# EAGLE design 1TTR4--- Cumbo.Fabio --- LED Double (EAGLE 7.7.0)
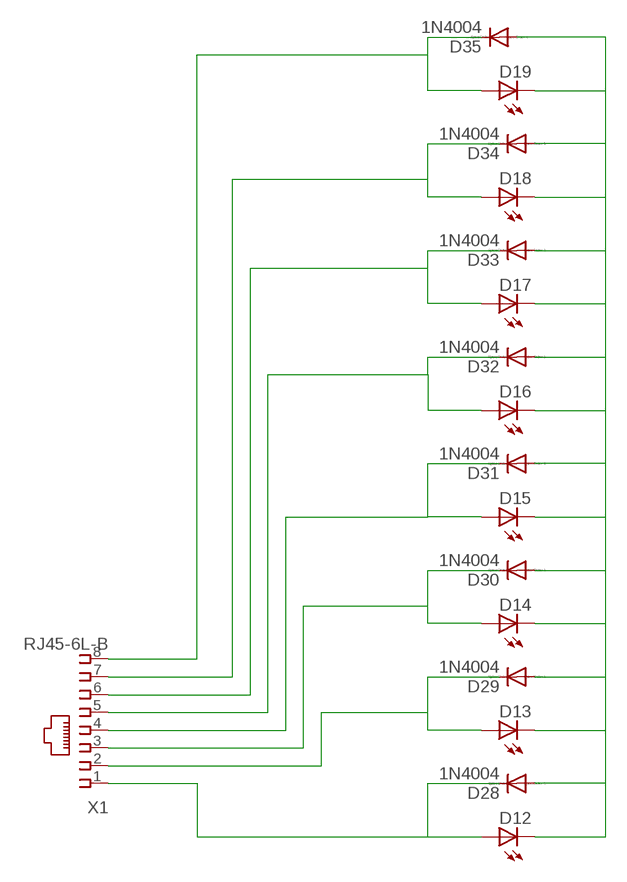
[diagram p0: schematic, sheet 1]

## Parts
D12  LED5MM  [LED5MM]
D13  LED5MM  [LED5MM]
D14  LED5MM  [LED5MM]
D15  LED5MM  [LED5MM]
D16  LED5MM  [LED5MM]
D17  LED5MM  [LED5MM]
D18  LED5MM  [LED5MM]
D19  LED5MM  [LED5MM]
D28  1N4004  [DO41-10]
D29  1N4004  [DO41-10]
D30  1N4004  [DO41-10]
D31  1N4004  [DO41-10]
D32  1N4004  [DO41-10]
D33  1N4004  [DO41-10]
D34  1N4004  [DO41-10]
D35  1N4004  [DO41-10]
X1  RJ45-6L-B  [RJ45-NO-SHIELD]

## Nets
N$1: D12.A D28.C X1.1
N$2: D12.K(C) D13.K(C) D14.K(C) D15.K(C) D16.K(C) D17.K(C) D18.K(C) D19.K(C) D28.A D29.A D30.A D31.A D32.A D33.A D34.A D35.A
N$3: D13.A D29.C X1.2
N$4: D14.A D30.C X1.3
N$5: D15.A D31.C X1.4
N$6: D16.A D32.C X1.5
N$7: D17.A D33.C X1.6
N$8: D18.A D34.C X1.7
N$9: D19.A D35.C X1.8

## Library data of the parts
D12-D19 = led:LED: LED OSRAM: - CHIPLED LG R971, LG N971, LY N971, LG Q971, LY Q971, LO R971, LY R971 LH N974, LH R974 LS Q976, LO Q976, LY Q976 LO Q996 - Hyper CHIPLED LW Q18S LB Q993, LB Q99A, LB R99A - SideLED LS A670, LO A670, LY A670, LG A670, LP A670 LB A673, LV A673, LT A673, LW A673 LH A674 LY A675 LS A676, LA A676, LO A676, LY A676, LW A676 LS A679, LY A679, LG A679 - Hyper Micro SIDELED® LS Y876, LA Y876, LO Y876, LY Y876 LT Y87S - SmartLED LW L88C, LW L88S LB L89C, LB L89S, LG L890 LS L89K, LO L89K, LY L89K LS L896, LA L896, LO L896, LY L896 - TOPLED LS T670, LO T670, LY T670, LG T670, LP T670 LSG T670, LSP T670, LSY T670, LOP T670, LYG T670 LG T671, LOG T671, LSG T671 LB T673, LV T673, LT T673, LW T673 LH T674 LS T676, LA T676, LO T676, LY T676, LB T676, LH T676, LSB T676, LW T676 LB T67C, LV T67C, LT T67C, LS T67K, LO T67K, LY T67K, LW E67C LS E67B, LA E67B, LO E67B, LY E67B, LB E67C, LV E67C, LT E67C LW T67C LS T679, LY T679, LG T679 LS T770, LO T770, LY T770, LG T770, LP T770 LB T773, LV T773, LT T773, LW T773 LH T774 LS E675, LA E675, LY E675, LS T675 LS T776, LA T776, LO T776, LY T776, LB T776 LHGB T686 LT T68C, LB T68C - Hyper Mini TOPLED® LB M676 - Mini TOPLED Santana® LG M470 LS M47K, LO M47K, LY M47K Source: http://www.osram.convergy.de LUXEON: - LUMILED® LXK2-PW12-R00, LXK2-PW12-S00, LXK2-PW14-U00, LXK2-PW14-V00 LXK2-PM12-R00, LXK2-PM12-S00, LXK2-PM14-U00 LXK2-PE12-Q00, LXK2-PE12-R00, LXK2-PE12-S00, LXK2-PE14-T00, LXK2-PE14-U00 LXK2-PB12-K00, LXK2-PB12-L00, LXK2-PB12-M00, LXK2-PB14-N00, LXK2-PB14-P00, LXK2-PB14-Q00 LXK2-PR12-L00, LXK2-PR12-M00, LXK2-PR14-Q00, LXK2-PR14-R00 LXK2-PD12-Q00, LXK2-PD12-R00, LXK2-PD12-S00 LXK2-PH12-R00, LXK2-PH12-S00 LXK2-PL12-P00, LXK2-PL12-Q00, LXK2-PL12-R00 Source: www.luxeon.com KINGBRIGHT: KA-3528ASYC Source: www.kingbright.com
D28-D35 = diode:1N4004: DIODE general purpose rectifier, 1 A
X1 = con-tycoelectronics:RJ45: CORCOM Modular RJ Jacks No Shield Source: www.tycoelectronics.com .. ENG_DS_1654001_1099_RJ_L_0507.pdf; MPN: RJ45-6L-B; OC_FARNELL: unknown; OC_NEWARK: 16R6090

## Net classes
0 default: width 2 mm, drill 0.8 mm, clearance 0.2 mm

## Board
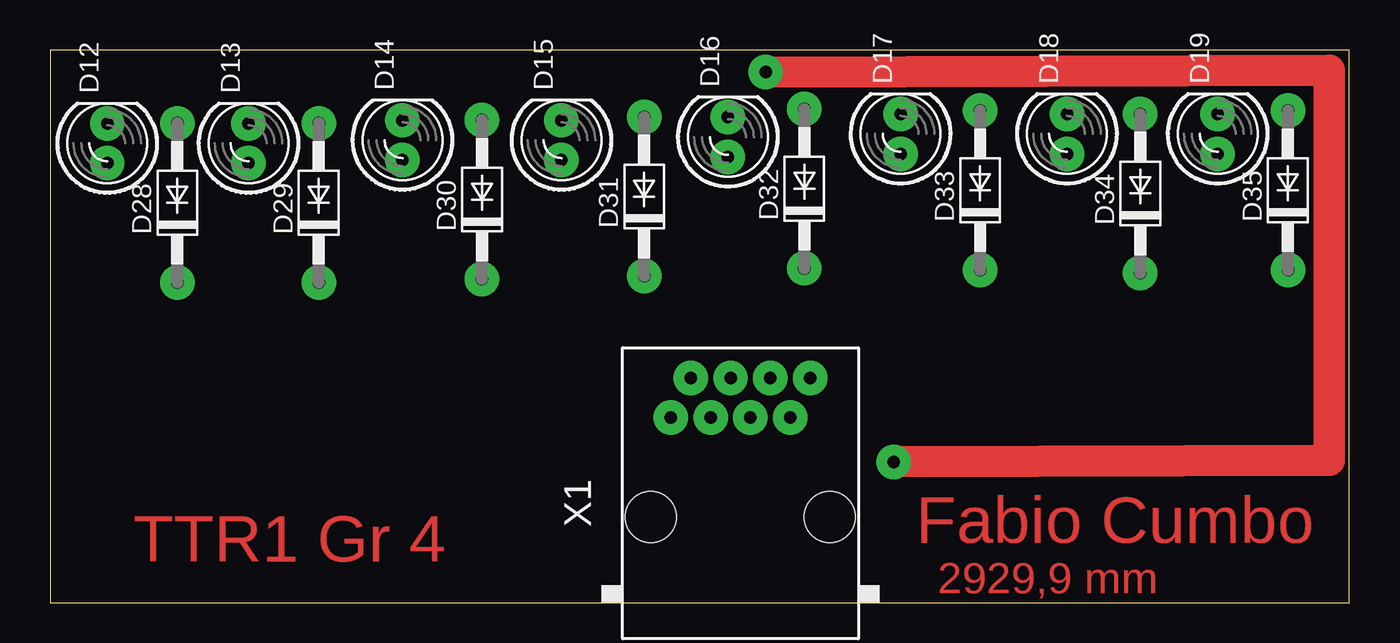
[diagram p1: board, top side]
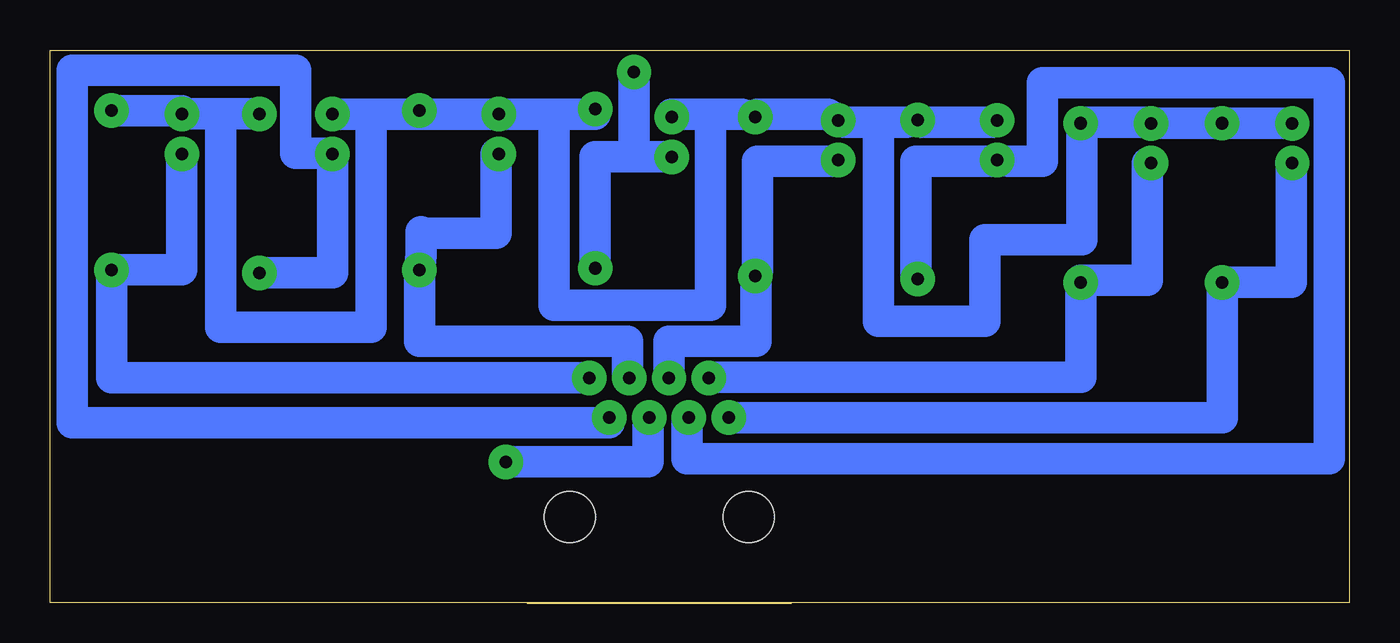
[diagram p2: board, bottom side, seen from below]

Size 83 x 35.33 mm. Coordinates in mm from the lower left corner, seen from the top.
Outline: 0,0.03 83,0.03 83,35.33 0,35.33 0,0.03
Copper layers (1*16): Top 0.035mm / dielectric 1.5mm / Bottom 0.035mm
Design rules "default": minimum track width 10mil, minimum drill 24mil, track to track 8mil, track to pad 8mil, pad to pad 8mil, via to via 8mil, smd to smd 8mil, copper to edge 40mil, drill to drill 8mil, minimum pad ring 10mil, minimum via ring 8mil, stop-mask expansion 4mil, vias tented up to drill 0mil, thermal gap 10mil

### Footprints (pad centres in the part's own frame; a part is rotated, then mirrored left to right if it is on the bottom)
LED5MM = drill 0.8 pad 2.2: A -1.27,0; K 1.27,0
DO41-10 = drill 0.8 pad 2.2: A 5.08,0; C -5.08,0
RJ45-NO-SHIELD = drill 0.8 pad 2.2: 1 -4.445,6.35; 2 -3.175,8.89; 3 -1.905,6.35; 4 -0.635,8.89; 5 0.635,6.35; 6 1.905,8.89; 7 3.175,6.35; 8 4.445,8.89 | hole 3.251: -5.715,0; 5.715,0

### Placement (x,y rotation side)
D12  3.65,29.38 90 top
D13  12.68,29.38 90 top
D14  22.51,29.58 90 top
D15  32.67,29.58 90 top
D16  43.3,29.78 90 top
D17  54.33,29.98 90 top
D18  64.96,29.98 90 top
D19  74.59,29.98 90 top
D28  8.13,25.58 90 top
D29  17.16,25.58 90 top
D30  27.59,25.78 90 top
D31  37.95,25.98 90 top
D32  48.18,26.48 90 top
D33  59.41,26.38 90 top
D34  69.64,26.18 90 top
D35  79.07,26.38 90 top
X1  44.1,5.51 0 top

### Tracks (layer width: path | path; a pad name or v marks a point on that pad's centre or on a via)
N$1
  Bottom 2: X1.1 8.13,11.86 D28.C 3.7,20.5 3.7,28.11 D12.A
N$2
  Bottom 2: 17.1,30.73 D29.A | D14.K 22.8,30.73 27.3,30.73 D30.A 28.3,30.73 30.1,30.73 | 30.1,30.73 32.3,30.73 D15.K 33.3,31.23 37.8,31.23 D31.A 38.8,31.23 40.8,31.23 | 17.1,30.73 17.1,23.23 23.3,23.23 23.3,18.03 30.1,18.03 30.1,30.73 | 40.8,31.23 43.3,31.23 D16.K | 40.8,31.23 40.8,19.03 50.8,19.03 50.8,31.23 | 50.8,31.23 50.8,31.25 D17.K 59.41,31.25 D33.A 59.5,31.46 59.5,31.23 62.5,31.23 | 62.5,31.23 62.5,17.63 72.1,17.63 72.1,31.26 D34.A D19.K 74.59,31.46 D35.A | 62.5,31.23 64.96,31.23 D18.K | D12.K D28.A D13.K 12.68,30.73 17.1,30.73 | 50.8,31.23 48.18,31.23 D32.A
N$3
  Bottom 2: X1.2 40.92,14.43 17.16,14.43 D29.C 17.16,20.63 12.9,20.63 12.9,28.11 D13.A
N$4
  Bottom 2: D30.C 27.7,20.73 27.7,28.23 22.8,28.23 D14.A 21.8,28.23 19.6,28.23 19.6,33.23 1.3,33.23 1.3,9.23 42.3,9.23 42.3,11.86 X1.3
N$5
  Bottom 2: D15.A 32.8,28.23 37.8,28.23 37.8,21.23 D31.C 37.9,20.9 37.9,16.73 43.46,16.73 X1.4
N$6  (via drill 0.8 pad 2.2)
  Top 2: v53.9,9.03 81.7,9.13 81.7,34.03 v45.7,33.93
  Bottom 2: X1.5 44.8,11.23 44.8,9.03 v53.9,9.03 | 45.7,28.53 48.18,28.53 D32.C | v45.7,33.93 45.7,28.53 | D16.A 45.7,28.51 45.7,28.53
N$7
  Bottom 2: 59.3,23.63 59.3,22.23 D33.C 59.41,16.73 46.1,16.73 46.1,14.6 X1.6 | D17.A 54.5,28.71 54.5,23.63 59.3,23.63 | 59.3,23.63 59.3,23.73
N$8
  Bottom 2: X1.7 47.3,11.53 81.6,11.53 81.6,34.03 67.3,34.03 67.3,28.73 65.3,28.73 D18.A 64.96,21.1 D34.C
N$9
  Bottom 2: D19.A 74.59,21.3 D35.C 79.07,14.4 X1.8

### Text on the board
Top: Fabio Cumbo | TTR1 Gr 4 | 2929,9 mm